# Altium schematic sheet CNCTS.SchDoc
size A4
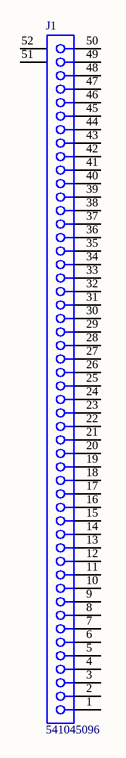
[diagram p0: CNCTS.SchDoc]

## Parts
J1  541045096  [541045096]

## Nets

Not connected (* = marked no-connect by the designer): J1 1 2 3 4 5 6 7 8 9 10 11 12 13 14 15 16 17 18 19 20 21 22 23 24 25 26 27 28 29 30 31 32 33 34 35 36 37 38 39 40 41 42 43 44 45 46 47 48 49 50 51(MH1) 52(MH2)

## Library data of the parts
J1 = 541045096: FPC/FFC Connector, Right Angle, SMT, ZIF, Top Contact Style, 50 Position, Pitch 0.50mm (.020"), Lead-free; PCB_Layout: Complies with manufacturer's FFC recommendation.; Published: 30-May-2008; DatasheetVersion: Aug-2006; PackageVersion: Jan-2004; PackageReference: 541045096; Publisher: Altium Limited; ComponentLink1Description: Manufacturer Link; ComponentLink1URL: http://www.molex.com/; ComponentLink2Description: Datasheet; ComponentLink2URL: http://www.molex.com/pdm_docs/ps/PS-54104-069.pdf; ComponentLink3Description: Packaging Specification; ComponentLink3URL: http://www.molex.com/pdm_docs/sd/541045031_sd.pdf